# Altium schematic sheet Sheet1.SchDoc
size D; SheetNumber: 1; SheetTotal: 2
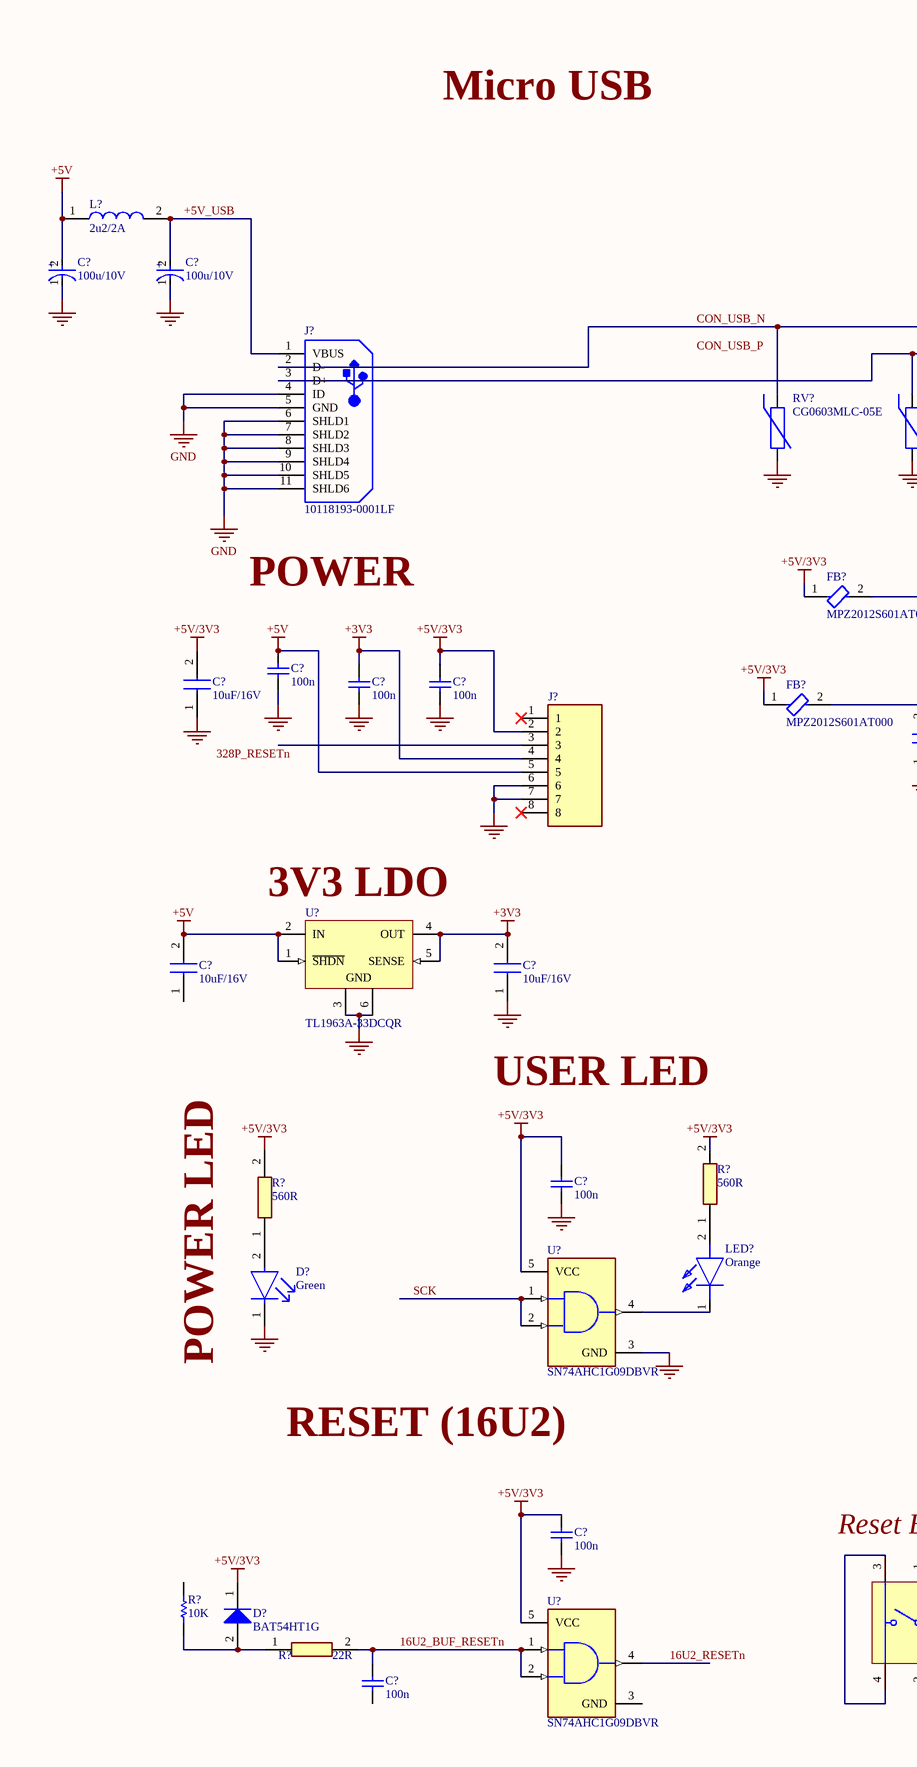
[diagram p0: Sheet1.SchDoc, left]
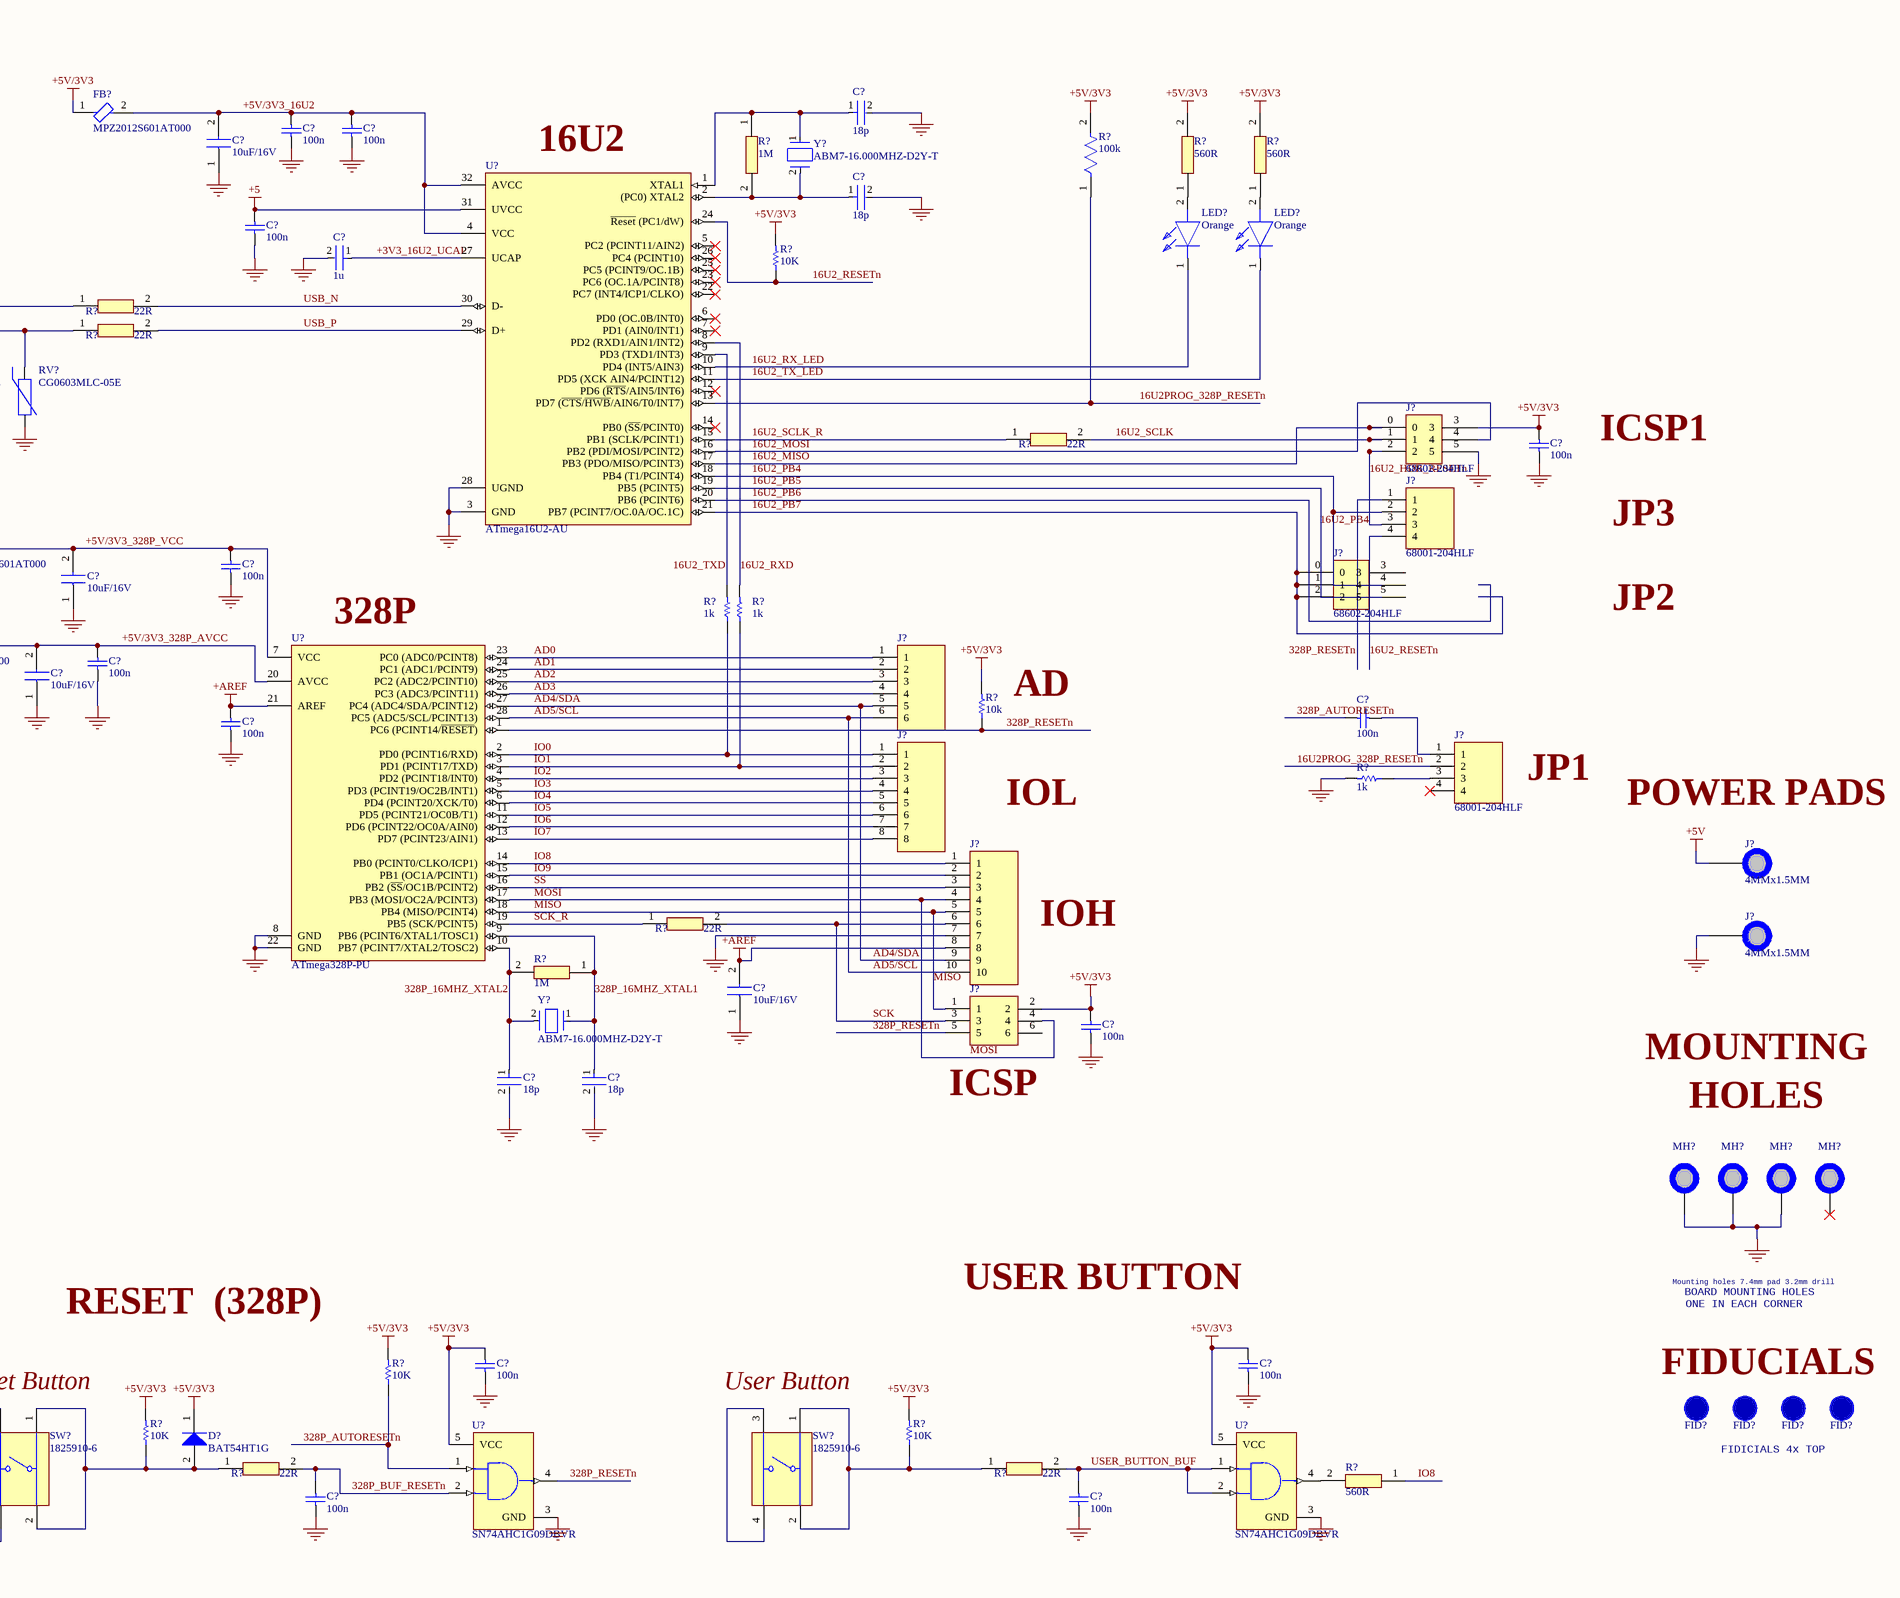
[diagram p1: Sheet1.SchDoc, right]

## Parts
(Parts that share a designator on the sheet are numbered #1, #2 ... from top to bottom, then left to right.)
C?#1  18p  [FP-C0805C-DN-MFG]
C?#2  100n  [CAPC2013X145X20LL20]
C?#3  100n  [CAPC2013X145X20LL20]
C?#4  10uF/16V  [CAPC2012X145N]
C?#5  18p  [FP-C0805C-DN-MFG]
C?#6  100u/10V  [FP-SC-MFG]
C?#7  100u/10V  [FP-SC-MFG]
C?#8  100n  [CAPC2013X145X20LL20]
C?#9  1u  [FP-C2012-125-0_2-IPC_A]
C?#10  100n  [CAPC2013X145X20LL20]
C?#11  100n  [CAPC2013X145X20LL20]
C?#12  10uF/16V  [CAPC2012X145N]
C?#13  100n  [CAPC2013X145X20LL20]
C?#14  100n  [CAPC2013X145X20LL20]
C?#15  100n  [CAPC2013X145X20LL20]
C?#16  10uF/16V  [CAPC2012X145N]
C?#17  100n  [CAPC2013X145X20LL20]
C?#18  10uF/16V  [CAPC2012X145N]
C?#19  100n  [CAPC2013X145X20LL20]
C?#20  100n  [CAPC2013X145X20LL20]
C?#21  10uF/16V  [CAPC2012X145N]
C?#22  10uF/16V  [CAPC2012X145N]
C?#23  10uF/16V  [CAPC2012X145N]
C?#24  100n  [CAPC2013X145X20LL20]
C?#25  18p  [FP-C0805C-DN-MFG]
C?#26  18p  [FP-C0805C-DN-MFG]
C?#27  100n  [CAPC2013X145X20LL20]
C?#28  100n  [CAPC2013X145X20LL20]
C?#29  100n  [CAPC2013X145X20LL20]
C?#30  100n  [CAPC2013X145X20LL20]
C?#31  100n  [CAPC2013X145X20LL20]
C?#32  100n  [CAPC2013X145X20LL20]
C?#33  100n  [CAPC2013X145X20LL20]
D?#1  Green  [FP-LG_L29K-MFG]
D?#2  BAT54HT1G  [ONSC-SOD-323-2-477-02_V]
D?#3  BAT54HT1G  [ONSC-SOD-323-2-477-02_V]
FB?#1  MPZ2012S601AT000  [FP-MPZ2012-MFG]
FB?#2  MPZ2012S601AT000  [FP-MPZ2012-MFG]
FB?#3  MPZ2012S601AT000  [FP-MPZ2012-MFG]
FID?#1  FID_1MMC  [FID_40X120D]  (value not drawn)  (no BOM)
FID?#2  FID_1MMC  [FID_40X120D]  (value not drawn)  (no BOM)
FID?#3  FID_1MMC  [FID_40X120D]  (value not drawn)  (no BOM)
FID?#4  FID_1MMC  [FID_40X120D]  (value not drawn)  (no BOM)
J?#1  10118193-0001LF  [FCI-10118193-0001LF-5_V]
J?#2  68602-204HLF
J?#3  68001-204HLF  [HDRV4W67P0X254_1X4_1016X241X858P]
J?#4  68602-204HLF
J?#5  M20-7820842  [RHDR8W80P0X254_1X8_2032X254X850P]  (value not drawn)
J?#6  M20-7820646  [HDRV6W70P0X254_1X6_1564X250X865P]  (value not drawn)
J?#7  M20-7820842  [RHDR8W80P0X254_1X8_2032X254X850P]  (value not drawn)
J?#8  68001-204HLF  [HDRV4W67P0X254_1X4_1016X241X858P]
J?#9  M20-7821046  [RHDR10W70P0X254_1X10_2580X250X865P]  (value not drawn)
J?#10  4MMx1.5MM  [PAD_WITH_HOLE_4MMx1.5MM]  (no BOM)
J?#11  4MMx1.5MM  [PAD_WITH_HOLE_4MMx1.5MM]  (no BOM)
J?#12  A2541WV-2x3P-C808D808-G15  [HDRV6W64P254_2X3_762X508X533P]  (value not drawn)
L?  2u2/2A  [INDC3225X270N]
LED?#1  Orange  [SODFL1708X67N]
LED?#2  Orange  [SODFL1708X67N]
LED?#3  Orange  [SODFL1708X67N]
MH?#1  MH_7.4MMC_3.2MMD  [MH_7.4MMD_3.2MMD]  (value not drawn)  (no BOM)
MH?#2  MH_7.4MMC_3.2MMD  [MH_7.4MMD_3.2MMD]  (value not drawn)  (no BOM)
MH?#3  MH_7.4MMC_3.2MMD  [MH_7.4MMD_3.2MMD]  (value not drawn)  (no BOM)
MH?#4  MH_7.4MMNC_3.2MMD  [MH_7.4MMD_3.2MMD_NON_COPPER_NPTH]  (value not drawn)  (no BOM)
R?#1  1M  [RESC2012X60N]
R?#2  100k  [FP-RC0805-0_6-IPC_C]
R?#3  560R  [RESC2012X60N]
R?#4  560R  [RESC2012X60N]
R?#5  10K  [RESC2013X60X35NL10T20]
R?#6  22R  [RESC2012X60N]
R?#7  22R  [RESC2012X60N]
R?#8  22R  [RESC2012X60N]
R?#9  1k  [RESC2013X60X35ML10T20]
R?#10  1k  [RESC2013X60X35ML10T20]
R?#11  10k  [RESC2013X60X35NL10T20]
R?#12  1k  [RESC2013X60X35ML10T20]
R?#13  22R  [RESC2012X60N]
R?#14  1M  [RESC2012X60N]
R?#15  560R  [RESC2012X60N]
R?#16  560R  [RESC2012X60N]
R?#17  10K  [RESC2013X60X35NL10T20]
R?#18  10K  [RESC2013X60X35NL10T20]
R?#19  10K  [RESC2013X60X35NL10T20]
R?#20  10K  [RESC2013X60X35NL10T20]
R?#21  22R  [RESC2012X60N]
R?#22  22R  [RESC2012X60N]
R?#23  560R  [RESC2012X60N]
R?#24  22R  [RESC2012X60N]
RV?#1  CG0603MLC-05E  [BOUR-CG0603-2_V]
RV?#2  CG0603MLC-05E  [BOUR-CG0603-2_V]
SW?#1  1825910-6  [TECO-1825910-6_V]
SW?#2  1825910-6  [TECO-1825910-6_V]
U?#1  ATmega16U2-AU  [32A_M]
U?#2  ATmega328P-PU  [28P3]
U?#3  TL1963A-33DCQR  [DCQ0006A_L]
U?#4  SN74AHC1G09DBVR  [FP-DBV0005A-MFG]
U?#5  SN74AHC1G09DBVR  [FP-DBV0005A-MFG]
U?#6  SN74AHC1G09DBVR  [FP-DBV0005A-MFG]
U?#7  SN74AHC1G09DBVR  [FP-DBV0005A-MFG]
Y?#1  ABM7-16.000MHZ-D2Y-T  [FP-ABM7-MFG]
Y?#2  ABM7-16.000MHZ-D2Y-T  [FP-ABM7-MFG]

## Nets
+3V3: C?#14.2 C?#22.2 J?#5.4 U?#3.4(OUT) U?#3.5(SENSE)
+5: C?#8.2 U?#1.31(UVCC)
+5V: C?#6.2(A) C?#13.2 C?#21.2 J?#5.5 J?#10.1 L?.1 U?#3.1(~{SHDN}) U?#3.2(IN)
+5V/3V3: C?#10.2 C?#15.2 C?#16.2 C?#24.2 C?#27.2 C?#28.2 C?#29.2 C?#30.2 D?#2.1(K) D?#3.1(K) FB?#1.1 FB?#2.1 FB?#3.1 J?#2.3 J?#5.2 J?#12.2 R?#2.2 R?#3.2 R?#4.2 R?#5.2 R?#11.2 R?#15.2 R?#16.2 R?#17.2 R?#18.2 R?#19.2 U?#4.5(VCC) U?#5.5(VCC) U?#6.5(VCC) U?#7.5(VCC)
+AREF: C?#20.2 C?#23.2 J?#9.8 U?#2.21(AREF)
GND: C?#1.2 C?#2.1 C?#3.1 C?#4.1 C?#5.2 C?#6.1(C) C?#7.1(C) C?#8.1 C?#9.2 C?#10.1 C?#11.1 C?#12.1 C?#13.1 C?#14.1 C?#15.1 C?#16.1 C?#17.1 C?#18.1 C?#20.1 C?#22.1 C?#23.1 C?#24.1 C?#25.2 C?#26.2 C?#27.1 C?#28.1 C?#29.1 C?#30.1 C?#31.1 C?#32.1 D?#1.1(C) J?#1.4(ID) J?#1.5(GND) J?#1.6(SHLD1) J?#1.7(SHLD2) J?#1.8(SHLD3) J?#1.9(SHLD4) J?#1.10(SHLD5) J?#1.11(SHLD6) J?#2.5 J?#5.6 J?#5.7 J?#9.7 J?#11.1 MH?#1.1 MH?#2.1 MH?#3.1 R?#12.2 RV?#1.2 RV?#2.2 U?#1.3(GND) U?#1.28(UGND) U?#2.8(GND) U?#2.22(GND) U?#3.3(GND) U?#3.6(GND) U?#4.3(GND) U?#5.3(GND) U?#6.3(GND)
16U2_BUF_RESETn: C?#33.2 R?#24.2 U?#7.1(A) U?#7.2(B)
16U2_HDR_RESETn: J?#2.2 J?#3.3
16U2_MISO: J?#2.0 U?#1.17(PB3_(PDO/MISO/PCINT3))
16U2_MOSI: J?#2.4 U?#1.16(PB2_(PDI/MOSI/PCINT2))
16U2_PB4: J?#3.2 U?#1.18(PB4_(T1/PCINT4))
16U2_PB5: U?#1.19(PB5_(PCINT5))
16U2_PB6: U?#1.20(PB6_(PCINT6))
16U2_PB7: J?#4.0 J?#4.1 J?#4.2 U?#1.21(PB7_(PCINT7/OC.0A/OC.1C))
16U2_RESETn: J?#3.4 R?#5.1 U?#1.24(~{Reset}_(PC1/dW)) U?#7.4(Y)
16U2_RX_LED: LED?#1.1(K) U?#1.10(PD4_(INT5/AIN3))
16U2_RXD: R?#10.2 U?#1.8(PD2_(RXD1/AIN1/INT2))
16U2_SCLK: J?#2.1 R?#8.2
16U2_SCLK_R: R?#8.1 U?#1.15(PB1_(SCLK/PCINT1))
16U2_TX_LED: LED?#2.1(K) U?#1.11(PD5_(XCK_AIN4/PCINT12))
16U2_TXD: R?#9.2 U?#1.9(PD3_(TXD1/INT3))
16U2PROG_328P_RESETn: J?#8.2 R?#2.1 U?#1.13(PD7_(~{CTS}/~{HWB}/AIN6/T0/INT7))
328P_16MHZ_XTAL1: C?#26.1 R?#14.1 U?#2.9(PB6_(PCINT6/XTAL1/TOSC1)) Y?#2.1
328P_16MHZ_XTAL2: C?#25.1 R?#14.2 U?#2.10(PB7_(PCINT7/XTAL2/TOSC2)) Y?#2.2
328P_AUTORESETn: C?#19.2 R?#17.1 U?#5.1(A)
328P_BUF_RESETn: C?#31.2 R?#21.2 U?#5.2(B)
328P_RESETn: J?#3.1 J?#5.3 J?#12.5 R?#11.1 U?#2.1(PC6_(PCINT14/~{RESET})) U?#5.4(Y)
+3V3_16U2_UCAP: C?#9.1 U?#1.27(UCAP)
+5V/3V3_16U2: C?#2.2 C?#3.2 C?#4.2 FB?#1.2 U?#1.4(VCC) U?#1.32(AVCC)
+5V/3V3_328P_AVCC: C?#17.2 C?#18.2 FB?#3.2 U?#2.20(AVCC)
+5V/3V3_328P_VCC: C?#11.2 C?#12.2 FB?#2.2 U?#2.7(VCC)
+5V_USB: C?#7.2(A) J?#1.1(VBUS) L?.2
AD0: J?#6.1 U?#2.23(PC0_(ADC0/PCINT8))
AD1: J?#6.2 U?#2.24(PC1_(ADC1/PCINT9))
AD2: J?#6.3 U?#2.25(PC2_(ADC2/PCINT10))
AD3: J?#6.4 U?#2.26(PC3_(ADC3/PCINT11))
AD4/SDA: J?#6.5 J?#9.9 U?#2.27(PC4_(ADC4/SDA/PCINT12))
AD5/SCL: J?#6.6 J?#9.10 U?#2.28(PC5_(ADC5/SCL/PCINT13))
CON_USB_N: J?#1.2(D-) R?#6.1 RV?#1.1
IO0: J?#7.1 R?#9.1 U?#2.2(PD0_(PCINT16/RXD))
IO1: J?#7.2 R?#10.1 U?#2.3(PD1_(PCINT17/TXD))
IO2: J?#7.3 U?#2.4(PD2_(PCINT18/INT0))
IO3: J?#7.4 U?#2.5(PD3_(PCINT19/OC2B/INT1))
IO4: J?#7.5 U?#2.6(PD4_(PCINT20/XCK/T0))
IO5: J?#7.6 U?#2.11(PD5_(PCINT21/OC0B/T1))
IO6: J?#7.7 U?#2.12(PD6_(PCINT22/OC0A/AIN0))
IO7: J?#7.8 U?#2.13(PD7_(PCINT23/AIN1))
IO8: J?#9.1 R?#23.1 U?#2.14(PB0_(PCINT0/CLKO/ICP1))
IO9: J?#9.2 U?#2.15(PB1_(OC1A/PCINT1))
MISO: J?#9.5 J?#12.1 U?#2.18(PB4_(MISO/PCINT4))
MOSI: J?#9.4 J?#12.4 U?#2.17(PB3_(MOSI/OC2A/PCINT3))
SCK: J?#9.6 J?#12.3 R?#13.2 U?#4.1(A) U?#4.2(B)
SCK_R: R?#13.1 U?#2.19(PB5_(SCK/PCINT5))
SS: J?#9.3 U?#2.16(PB2_(~{SS}/OC1B/PCINT2))
USB_N: R?#6.2 U?#1.30(D-)
USB_P: R?#7.2 U?#1.29(D+)
USER_BUTTON_BUF: C?#32.2 R?#22.2 U?#6.1(A) U?#6.2(B)
NetC?#1_1: C?#1.1 R?#1.1 U?#1.1(XTAL1) Y?#1.1
NetC?#5_1: C?#5.1 R?#1.2 U?#1.2((PC0)_XTAL2) Y?#1.2
NetC?#19_1: C?#19.1 J?#8.1
NetD?#1_2: D?#1.2(A) R?#16.1
NetD?#2_2: D?#2.2(A) R?#18.1 R?#21.1 SW?#1.1 SW?#1.2
NetD?#3_2: D?#3.2(A) R?#20.1 R?#24.1
NetJ?#1_3: J?#1.3(D+) R?#7.1 RV?#2.1
NetJ?#8_3: J?#8.3 R?#12.1
NetLED?#1_2: LED?#1.2(A) R?#3.1
NetLED?#2_2: LED?#2.2(A) R?#4.1
NetLED?#3_1: LED?#3.1(K) U?#4.4(Y)
NetLED?#3_2: LED?#3.2(A) R?#15.1
NetR?#19_1: R?#19.1 R?#22.1 SW?#2.1 SW?#2.2
NetR?#23_2: R?#23.2 U?#6.4(Y)
NetSW?#1_3: SW?#1.3 SW?#1.4
NetSW?#2_3: SW?#2.3 SW?#2.4

Not connected (* = marked no-connect by the designer): C?#21 1; C?#33 1; J?#4 3 4 5; J?#5 1* 8*; J?#8 4*; J?#12 6; MH?#4 1*; R?#20 2; U?#1 5(PC2_(PCINT11/AIN2))* 6(PD0_(OC.0B/INT0))* 7(PD1_(AIN0/INT1))* 12(PD6_(~{RTS}/AIN5/INT6))* 14(PB0_(~{SS}/PCINT0))* 22(PC7_(INT4/ICP1/CLKO))* 23(PC6_(OC.1A/PCINT8))* 25(PC5_(PCINT9/OC.1B))* 26(PC4_(PCINT10))*; U?#7 3(GND)

## Notes on the sheet
- Micro USB
- (near U?#1) 16U2
- ICSP1
- JP3
- POWER
- (near U?#2) 328P
- JP2
- (near R?#11) AD
- IOL
- JP1
- POWER PADS
- (near U?#3) 3V3 LDO
- IOH
- USER LED
- POWER LED
- (near J?#12) ICSP
- MOUNTING
- HOLES
- USER BUTTON
- Mounting holes 7.4mm pad 3.2mm drill
- BOARD MOUNTING HOLES
- (near U?#4) RESET (16U2)
- RESET  (328P)
- ONE IN EACH CORNER
- Reset Button
- User Button
- (near FID?#1) FIDUCIALS
- (near FID?#2) FIDICIALS 4x TOP
- Labels drawn without touching a wire or pin: CON_USB_P
- (in symbol CMP-05427-000047-1) +

## Library data of the parts
C?#1 C?#5 C?#25 C?#26 = CMP-2007-00302-2: CAP CER 18PF 50V C0G/NP0 0805; Manufacturer: KEMET; Manufacturer Part Number: C0805C180J5GACTU; Temperature Characteristic: C0G; Tolerance: 0.05; Material: Ceramic; Temperature Coefficient: 30ppm/°C; Device Class L2: Capacitors; Capacitance: 18 pF; Temperature: -55°C to +125°C; Value: 18 pF; Package: C0805C-DN; Mouser Description: Cap Ceramic 18pF 50V C0G 5% SMD 0805 125C Paper T/R; Height: 0.88mm; ComponentLink2URL: https://content.kemet.com/datasheets/KEM_C1003_C0G_SMD.pdf; RoHS: TRUE; Octopart: https://octopart.com/c0805c180j5gactu-kemet-144810; ComponentLink2Description: Datasheet; Temperature Range High: +125°C; Digikey Description: CAP CER 18PF 50V C0G/NP0 0805; Device Class L1: Passive Components; Category: Cap; Automotive: No; Device Class L3: Ceramic Capacitors; Voltage Rating: 50 V; Temperature Range Low: -55°C; Ipc Land Pattern Name: CAPC200125X78; Lead Free: Yes
C?#2 C?#3 C?#8 C?#10 C?#11 C?#13-C?#15 C?#17 C?#19 C?#20 C?#24 C?#27-C?#33 = CMP-2000-07557-1: Chip Capacitor, 0.1 uF, +/- 10%, 50 V, -55 to 125 degC, 0805 (2012 Metric), RoHS, Tape and Reel; Manufacturer: TDK; Voltage Rating: 50V; Dielectric Material: Ceramic; Capacitance: 100nF; Dielectric: X7R; Datasheet Version: 07/2017; Max Operating Temperature: 125degC; RoHSCompliant: True; Min Operating Temperature: -55degC; Case/Package: 0805; Composition: Ceramic; Width: 0.049inch; Thickness: 0.037inch; Datasheet URL: https://product.tdk.com/info/en/catalog/datasheets/mlcc_commercial_general_en.pdf; Height: 0.85mm; Voltage Rating (DC): 50V; Voltage: 50V; Packaging: TapeandReel; Mounting Technology: SurfaceMount; Case Code (Metric): 2012; Length: 2mm; Radiation Hardening: No; Number of Pins: 2; REACH SVHC: NoSVHC; Lead Free: LeadFree; Package Reference: 805; Weight: 0.000194oz; Tolerance: 10%; Package Description: 2-Pin Surface Mount Device, Body 2 x 1.25 mm; Manufacturer URL: http://www.tdk.com/; Package Quantity: 1; Case Code (Imperial): 0805; Mount: SurfaceMount; Depth: 1.25mm; Termination: SMD/SMT
C?#4 C?#12 C?#16 C?#18 C?#21-C?#23 = C2012X5R1C106M125AC: Capacitor; Manufacturer_Name: TDK; Datasheet Link: https://product.tdk.com/info/en/catalog/datasheets/mlcc_commercial_midvoltage_en.pdf; Height: 1.45mm; Manufacturer_Part_Number: C2012X5R1C106M125AC; Mouser Part Number: 810-C2012X5R1C106M-3; Mouser Price/Stock: https://www.mouser.co.uk/ProductDetail/TDK/C2012X5R1C106M125AC?qs=LcTL%2F5vFEzHcq9TBdtOIgw%3D%3D
C?#6 C?#7 = CMP-05427-000047-1: CAP ALUM 100UF 20% 10V SMD; Life (Hours): 1000Hour; Ripple Current: 50mA; Packaging: Tape and Reel; Diameter: 5mm; Voltage Rating (DC): 10V; Mount: Surface Mount; Max Operating Temperature: 85°C; Length: 5.5mm; Case/Package: Radial; Height: 5.4mm; Construction: Cylindrical; Termination: SMD/SMT; Height - Seated (Max): 0.213inch; Series: S; Min Operating Temperature: -40°C; Capacitance: 100uF; Tolerance: 20%; Voltage Rating: 10V; Package Quantity: 1; Radiation Hardening: No; Ripple Current (AC): 50mA; Lead Free: Lead Free; RoHS Compliant: Yes; Contact Plating: Tin
C?#9 = CMP-08246-005389-1: Multilayer Ceramic Capacitors 1μF ±10% 25V X5R SMD 0805; Capacitance: 1uF; Min Operating Temperature: -55°C; Construction: Flat; Package Quantity: 2000; Height: 1.25mm; Resistor Type: Ceramic; Case/Package: 0805; Depth: 1.25mm; Case Code (Metric): 2012; Weight: 0.000194oz; REACH SVHC: No SVHC; Dielectric: X5R; Max Operating Temperature: 85°C; Number of Pins: 2; Thickness: 0.057inch; RoHS Compliant: Yes; Radiation Hardening: No; Lead Free: Lead Free; Case Code (Imperial): 0805; Length: 2mm; Voltage Rating: 25V; Mount: Surface Mount; Voltage Rating (DC): 25V; Packaging: Tape and Reel; Dielectric Material: Ceramic; Termination: SMD/SMT; Voltage: 25V; Tolerance: 10%; Series: C; Width: 0.049inch
D?#1 = CMP-62016-000024-1: LED GREEN DIFFUSED 0603 SMD; Number of LEDs: 1; Forward Current: 20mA; Luminous Intensity: 5.6mcd; Luminous Flux: 0.012lm; Dominant Wavelength: 570nm; Lens Style: Flat; Forward Voltage: 2.2V; Reverse Voltage: 12V; Viewing Angle: 160°; Lens Size: 0.8mm; Test Current: 2mA; Lens Color: White; Length: 1.3mm; Radiation Hardening: No; Color: Green; Number of Pins: 2; Depth: 0.8mm; Number of Elements: 1; Case Code (Metric): 1608; Case Code (Imperial): 0603; Illumination Color: Green; Width: 0.8mm; Lens Transparency: Diffused; Mount: Surface Mount; Min Operating Temperature: -40°C; Packaging: Tape and Reel; Max Operating Temperature: 100°C; Case/Package: 0603; Height: 0.65mm; Package Quantity: 5000
D?#2 D?#3 = CMP-1055-00462-1: Schottky Barrier Diode, 2-Pin SOD-323, Pb-Free, Tape and Reel; Manufacturer: On Semiconductor; Configuration: Single; trr Max (ns): 5; IFSM Max (A): 0.6; ComponentLink3URL: http://www.onsemi.com/pub_link/Collateral/477-02.PDF.1; PackageDescription: 2-Pin SOD, Body 1.7 x 1.25 mm; ComponentLink2URL: http://www.onsemi.cn/pub_link/Collateral/BAT54HT1-D.PDF; ComponentLink3Description: Package Specification; ComponentLink2Description: Datasheet; DatasheetVersion: Rev. 6; PackageReference: SOD-323-2-477-02; RoHS: TRUE; ComponentLink1URL: http://www.onsemi.com/; Packing: Tape and Reel; PartNumber: BAT54HT1G; Mounting Technology: Surface Mount; ComponentLink1Description: Manufacturer URL; PackageVersion: Rev. H, 03/2007
FB?#1-FB?#3 = CMP-2000-05401-2: Manufacturer Lifecycle Status: PRODUCTION; NexarPartId: 12090955; RMS Current (Irms): 2A; Test Frequency: 100MHz; Tolerance: 25%; Core Material: Ferrite; Series Resistance: 100mΩ; Impedance: 600Ω; Packaging: Digi-Reel®; Length: 2mm; Min Operating Temperature: -55°C; Width: 1.25mm; Max Width: 1.45mm; Lead Free: Lead Free; Current Rating: 2A; Case Code (Imperial): 0805; Min Length: 1.8mm; Schedule B: 8504500000, 8504500000; REACH SVHC: No SVHC; Case Code (Metric): 2012; Max DC Current: 2A; Case/Package: 0805; Lifecycle Status: Production; Min Width: 1.05mm; Mount: Surface Mount; Height: 1.0414mm; Resistance: 100mΩ; DC Resistance (DCR): 100mΩ; Max Operating Temperature: 125°C; Max Length: 2.2mm; RoHS: Compliant
FID?#1-FID?#4 = FID_1MMC: Fiducial 40mil Diameter, 120mil Mask; Supplier: Digikey
J?#1 = CMP-2000-05119-1: Micro USB B Type Receptacle, -55 to 85 degC, 5-Pin SMD, RoHS, Tape and Reel; Manufacturer: FCI; Insulation Resistance: 1000MOhms; Gender: Female; Current Rating: 1.8A; Number of Contacts: 5Contact; Connector Type: MicroUSBTypeBreceptacle; Mounting Angle: Right; Datasheet Version: Rev. C, 05/2015; Packaging: Reel; Product Category: USBConnectors; Standard: USB2.0; Factory Pack Quantity: 1200; Operating Temperature Range: -55Cto+85C; Termination Style: SMD/SMT; Datasheet URL: http://datasheet.octopart.com/10118193-0001LF-FCI-datasheet-55953155.pdf; Contact Material: CopperAlloy; RoHS: Details; Contact Plating: Gold; Flammability Rating: UL94V-0; Manufacturer URL: http://www.fci.com/; Brand: FCI; Product: MicroUSBTypeBConnectors; Color: Black
J?#2 J?#4 = 68602-204HLF: CONN HEADER VERT 4POS 2.54MM; Manufacturer: Amphenol ICC / FCI; Supplier: Newark; Supplier Part Number: 28AH8858; Manufacturer Part Number: 68602-204HLF; RoHS: No; Category: Connectors; Pricing: 1=0,245, 10=0,243, 25=0,241, 50=0,238, 100=0,236, 250=0,234 (USD); ComponentLink1URL: https://cdn.amphenol-icc.com/media/wysiwyg/files/drawing/67996.pdf?src-supplier=Digikey; ComponentLink1Description: https://cdn.amphenol-icc.com/media/wysiwyg/files/drawing/67996.pdf?src-supplier=Digikey; ComponentLink2URL: https://cdn.amphenol-icc.com/media/wysiwyg/files/drawing/67996.pdf?src-supplier=Avnet; ComponentLink2Description: https://cdn.amphenol-icc.com/media/wysiwyg/files/drawing/67996.pdf?src-supplier=Avnet; ComponentLink3URL: https://cdn.amphenol-icc.com/media/wysiwyg/files/drawing/67996.pdf?src-supplier=Mouser; ComponentLink3Description: https://cdn.amphenol-icc.com/media/wysiwyg/files/drawing/67996.pdf?src-supplier=Mouser; ComponentLink4URL: https://datasheet.octopart.com/68602-204HLF-Amphenol-Communications-Solutions-datasheet-36854132.pdf?src-supplier=Newark; ComponentLink4Description: https://datasheet.octopart.com/68602-204HLF-Amphenol-Communications-Solutions-datasheet-36854132.pdf?src-supplier=Newark; ComponentLink5URL: https://cdn.amphenol-icc.com/media/wysiwyg/files/drawing/67996.pdf?src-supplier=Allied+Electronics; ComponentLink5Description: https://cdn.amphenol-icc.com/media/wysiwyg/files/drawing/67996.pdf?src-supplier=Allied+Electronics; ComponentLink6URL: https://cdn.amphenol-icc.com/media/wysiwyg/files/drawing/67996.pdf?src-supplier=Heilind+Electronics; ComponentLink6Description: https://cdn.amphenol-icc.com/media/wysiwyg/files/drawing/67996.pdf?src-supplier=Heilind+Electronics
J?#3 J?#8 = 68001-204HLF: Connector; Manufacturer_Name: Amphenol Communications Solutions; Datasheet Link: https://cdn.amphenol-cs.com/media/wysiwyg/files/drawing/68000.pdf; Height: 8.58mm; Manufacturer_Part_Number: 68001-204HLF
J?#5 J?#7 = M20-7820842: Connector; Manufacturer_Name: Harwin; Datasheet Link: https://cdn.harwin.com/pdfs/M20-782.pdf; Height: 8.5mm; Manufacturer_Part_Number: M20-7820842; Mouser Part Number: 855-M20-7820842; Mouser Price/Stock: https://www.mouser.co.uk/ProductDetail/Harwin/M20-7820842?qs=WS5Jv%252B%252Bx1qXOep0XOTvy2Q%3D%3D
J?#6 = M20-7820646: Connector; Manufacturer_Name: Harwin; Datasheet Link: https://cdn.harwin.com/pdfs/M20-782.pdf; Height: 8.65mm; Manufacturer_Part_Number: M20-7820646; Mouser Part Number: 855-M20-7820646; Mouser Price/Stock: https://www.mouser.co.uk/ProductDetail/Harwin/M20-7820646?qs=WS5Jv%252B%252Bx1qWZs4rbTjPGWw%3D%3D
J?#9 = M20-7821046: Connector; Manufacturer_Name: Harwin; Datasheet Link: https://cdn.harwin.com/pdfs/M20-782.pdf; Height: 8.65mm; Manufacturer_Part_Number: M20-7821046; Mouser Part Number: 855-M20-7821046; Mouser Price/Stock: https://www.mouser.co.uk/ProductDetail/Harwin/M20-7821046?qs=Jph8NoUxIfXTsFl0wvOA6g%3D%3D
J?#10 J?#11 = PAD_WITH_HOLE_4MMx1.5MM: Pad with a hole 4mm x 1.5mm
J?#12 = A2541WV-2x3P-C808D808-G15: Connector; Manufacturer_Name: Changjiang Connectors; Datasheet Link: https://www.cjt.com/Upload/A2541.pdf; Height: 5.33mm; Manufacturer_Part_Number: A2541WV-2x3P-C808D808-G15
L? = L1210R2R2MDWIT: Inductor; Manufacturer_Name: KEMET; Datasheet Link: https://content.kemet.com/datasheets/KEM_L9015_L-DWI.pdf; Height: 2.7mm; Manufacturer_Part_Number: L1210R2R2MDWIT; Mouser Part Number: 80-L1210R2R2MDWIT; Mouser Price/Stock: https://www.mouser.co.uk/ProductDetail/KEMET/L1210R2R2MDWIT?qs=v1sh8PPj49i7zaK1i33Fzg%3D%3D; Arrow Part Number: L1210R2R2MDWIT; Arrow Price/Stock: https://www.arrow.com/en/products/l1210r2r2mdwit/kemet-corporation?region=nac
LED?#1-LED?#3 = LO_L29K-H2K1-24-Z: LED; Manufacturer_Name: ams OSRAM; Manufacturer_Part_Number: LO L29K-H2K1-24-Z; Datasheet Link: https://datasheet.datasheetarchive.com/originals/distributors/DKDS41/DSANUWW0036666.pdf; Height: 0.67mm; Mouser Part Number: 720-LOL29KH2K124Z; Mouser Price/Stock: https://www.mouser.com/Search/Refine.aspx?Keyword=720-LOL29KH2K124Z; Arrow Part Number: LO L29K-H2K1-24-Z; Arrow Price/Stock: https://www.arrow.com/en/products/lol29k-h2k1-24-z/osram-opto-semiconductors
MH?#1-MH?#3 = MH_7.4MMC_3.2MMD: Mounting Hole 7.4mm Diameter, 3.2mm Drill; .Creator: MM
MH?#4 = MH_7.4MMNC_3.2MMD: Mounting Hole 7.4mm Diameter (Non Copper), 3.2mm Drill NPTH
R?#1 R?#14 = RC0805FR-071ML: Resistor; Manufacturer_Name: KEMET; Datasheet Link: http://www.yageo.com/documents/recent/PYu-RC_Group_51_RoHS_L_10.pdf; Height: 0.6mm; Manufacturer_Part_Number: RC0805FR-071ML; Mouser Part Number: 603-RC0805FR-071ML; Mouser Price/Stock: https://www.mouser.co.uk/ProductDetail/YAGEO/RC0805FR-071ML?qs=8Y8p%252BasKcI6wvSL4jxV1pQ%3D%3D; Arrow Part Number: RC0805FR-071ML; Arrow Price/Stock: https://www.arrow.com/en/products/rc0805fr-071ml/yageo?region=europe
R?#2 = CMP-2100-03668-5: RES 100K OHM 1% 1/8W 0805; Power Rating: 125mW; Temperature Coefficient: 100ppm/°C; Voltage Rating (DC): 150V; Resistance: 100kR; Package Quantity: 1; Case/Package: 0805; Lead Pitch: 0.4mm; Case Code (Imperial): 0805; Construction: Rectangular; Number of Terminations: 2; RoHS Compliant: Yes; Max Power Dissipation: 125mW; Tolerance: 1%; Max Operating Temperature: 155°C; Resistance Tolerance: 1%; Lead Free: Lead Free; Packaging: Tape and Reel; Resistor Type: Thick Film; Min Operating Temperature: -55°C; Case Code (Metric): 2012; Series: RC; Technology: THICK FILM; Voltage Rating: 150V; Termination: SMD/SMT; Width: 0.049inch; Number of Pins: 2; Features: Moisture Resistant; Military Standard: Not; Length: 0.079inch; Depth: 1.25mm; Size Code: 0805; Height: 0.024inch
R?#3 R?#4 R?#15 R?#16 R?#23 = RC0805FR-07560RL: Resistor; Manufacturer_Name: KEMET; Datasheet Link: http://www.yageo.com/documents/recent/PYu-RC_Group_51_RoHS_L_10.pdf; Height: 0.6mm; Manufacturer_Part_Number: RC0805FR-07560RL; Mouser Part Number: 603-RC0805FR-07560RL; Mouser Price/Stock: https://www.mouser.co.uk/ProductDetail/YAGEO/RC0805FR-07560RL?qs=g6xwsc4j%252B%2Foqaguphwrcog%3D%3D; Arrow Part Number: RC0805FR-07560RL; Arrow Price/Stock: https://www.arrow.com/en/products/rc0805fr-07560rl/yageo?region=nac
R?#5 R?#11 R?#17-R?#20 = CMP-1659-00013-4: Chip Resistor, 10 KOhm, +/- 1%, 0.125 W, -55 to 155 degC, 0805 (2012 Metric), RoHS, Tape and Reel; Manufacturer: Yageo; Voltage Rating: 150 V; Mount: Surface Mount; ComponentLink1Description: Manufacturer URL; ComponentLink2URL: http://www.yageo.com/documents/recent/PYu-RC_Group_51_RoHS_L_04.pdf; Pins: 2; Length: 2 mm; Min Operating Temperature: -55 degC; Height: 0.5 mm; Mounting Technology: Surface Mount; RoHSCompliant: true; REACH SVHC: No SVHC; ComponentLink1URL: http://www.yageo.com/; Max Operating Temperature: 155 degC; PackageReference: 0805; DatasheetVersion: Rev. 4, 02/2016; Package Quantity: 5000; Packaging: Tape and Reel; ComponentLink2Description: Datasheet; PackageDescription: 2-Pin Surface Mounted Device, Body 2 x 1.25 mm
R?#6-R?#8 R?#13 R?#21 R?#22 R?#24 = RC0805FR-0722RL: Resistor; Manufacturer_Name: KEMET; Datasheet Link: http://www.yageo.com/documents/recent/PYu-RC_Group_51_RoHS_L_10.pdf; Height: 0.6mm; Manufacturer_Part_Number: RC0805FR-0722RL; Mouser Part Number: 603-RC0805FR-0722RL; Mouser Price/Stock: https://www.mouser.com/Search/Refine.aspx?Keyword=603-RC0805FR-0722RL; Arrow Part Number: RC0805FR-0722RL; Arrow Price/Stock: https://www.arrow.com/en/products/rc0805fr-0722rl/yageo
R?#9 R?#10 R?#12 = CMP-2100-03671-1: Chip Resistor, 1 KOhm, +/- 1%, 125 mW, -55 to 155 degC, 0805 (2012 Metric), RoHS, Tape and Reel; Manufacturer: Yageo; Temperature Coefficient: 100ppm/degreesC; Voltage Rating (DC): 150V; Max Power Dissipation: 125mW; Resistance: 1KOhm; Number of Pins: 2; Number of Terminations: 2; Datasheet URL: http://www.yageo.com/NewPortal/yageodocoutput?fileName=/pdf/R-Chip/PYu-RC_Group_51_RoHS_L_5.pdf; Length: 0.079inch; Package Description: 2-Pin Surface Mounted Device, Body 2 x 1.25 mm; Depth: 1.25mm; Height: 0.024inch; Military Standard: Not; Case/Package: 0805; Package Reference: 0805; RoHSCompliant: true; Lead Free: LeadFree; Packaging: TapeandReel; Package Quantity: 1; Datasheet Version: Rev. 5, 10/2016; Tolerance: 1%; Min Operating Temperature: -55degC; Voltage Rating: 150V; Composition: ThickFilm; Case Code (Imperial): 0805; Power Rating: 125mW; Width: 0.049inch; Case Code (Metric): 2012; Manufacturer URL: http://www.yageo.com/; Max Operating Temperature: 155degC; REACH SVHC: Unknown; Termination: SMD/SMT
RV?#1 RV?#2 = CMP-0584-00001-2: ESD Protector, 5 V Supply, -40 to 85 degC, 1.6 x 0.8 x 0.55 mm SMD, RoHS, Tape and Reel; Manufacturer: Bourns; VC: 20 V; VT: 150 V; RT: 1 ns; VDC: 5 V; CO: 0.5 pF; PartNumber: CG0603MLC-05E; ComponentLink1Description: Manufacturer URL; ComponentLink1URL: http://www.bourns.com/; Packing: Tape and Reel; Mounting Technology: Surface Mount; ComponentLink2Description: Datasheet; RoHS: TRUE; Operating Temperature: -40 to 85 degC; DatasheetVersion: Rev. S; PackageDescription: 2-Pin SMD, Body 1.6 x 0.8 mm, Pitch 1.52 mm; PackageReference: CG0603-2; ComponentLink2URL: http://www.bourns.com/data/global/pdfs/MLC.pdf
SW?#1 SW?#2 = CMP-1684-00021-1: Tact Switch, SPST-NO, 0.05 A, -35 to 85 degC, 4-Pin THD, RoHS, Bulk; Manufacturer: TE Connectivity; Maximum Contact Resistance: 100mOhm; Mechanical Life: 100000Cycles; Bushing Type: Unthreaded; Switch Configuration: OFF(ON); Maximum DC Voltage Rating: 24V; Contact Rating @ Voltage: 0.05A@24VDC; Actuator Color: Black; Body Orientation: Straight; Function: MomentaryContact; Illumination: N/R; Actuator Style: RoundButton; Actuator Material: PolybutyleneTerephthalate; Dielectric Strength: 500VAC; Pole Throw Configuration: SPST; Actuator Length: 1.4mm; Product Weight: N/A; Contact Material: CopperAlloy; Housing Material: N/A; Terminal Type: PCPins; Minimum Insulation Resistance: 100MOhm; Package Description: 4-Pin Through Hole Device, Body 5.99 x 5.99 mm, Pitch 6.5 mm; Part No: 1825910-6; Package Reference: THD; Base Material: N/A; Manufacturer URL: http://www.te.com; Contact Plating: Silver; RoHS: Yes; Datasheet Version: Rev. C9; Electrical Life: 100000Cycles; Maximum AC Voltage Rating: N/A; Thread Size: N/R; Operating Temperature: -35to85C; Mounting: ThroughHole; Dimension: 5.99x5mm; Datasheet URL: http://www.te.com/commerce/DocumentDelivery/DDEController?Action=showdoc&DocId=Customer+Drawing%7F1825910%7FC9%7Fpdf%7FEnglish%7FENG_CD_1825910_C9.pdf%7F1825910-6; Family: 1825910; Seal Location: N/A; Seal Description: N/A; Packaging: N/A
U?#1 = CMP-0095-00303-3: 8-bit AVR Microcontroller, 2.7-5.5V, 16KB Flash, 512 Bytes EEPROM, 512 Bytes SRAM, 32-pin TQFP, Industrial Grade (-40°C to 85°C); RevisionNote: Schematic symbol corrected; PartNumber: ATmega16U2-AU; ComponentLink1URL: http://www.atmel.com/; ComponentLink2Description: ATmega8U2/16U2/32U2 Datasheet; PackageDescription: 32-Lead, 7x7x1.0 mm Body, 0.8mm Lead Pitch, Thin Profile Plastic Quad Flat Package (TQFP); Code_JEDEC: MS-026-ABA; DatasheetVersion: revD, Nov-2010; ComponentLink2URL: http://www.atmel.com/dyn/resources/prod_documents/doc7799.pdf; ComponentLink3URL: http://www.atmel.com/dyn/resources/prod_documents/7799S.pdf; ComponentLink3Description: ATmega8U2/16U2/32U2 Summary; PackageReference: 32A; PackageVersion: revC, Oct-2010; ComponentLink1Description: Manufacturer URL
U?#2 = CMP-0095-00013-2: 8-bit AVR Microcontroller, 32KB Flash, 1KB EEPROM, 2KB SRAM, 28-pin PDIP, Industrial Grade (-40°C to 85°C); RevisionNote: DatasheetVersion updated. URLs added.; PackageVersion: revB, Sep-2001; PackageDescription: 28-lead (0.300"/7.62mm Wide) Plastic Dual Inline Package (PDIP); DatasheetVersion: revD, May-2011; ComponentLink1Description: Manufacturer URL; ComponentLink1URL: http://www.atmel.com/; PackageReference: 28P3; ComponentLink2Description: ATmega48A/48PA/88A/88PA/168A/168PA/328/328P Datasheet; ComponentLink3URL: http://www.atmel.com/dyn/resources/prod_documents/8271S.pdf; ComponentLink2URL: http://www.atmel.com/dyn/resources/prod_documents/8271.pdf; ComponentLink3Description: ATmega48A/48PA/88A/88PA/168A/168PA/328/328P Summary
U?#3 = CMP-0395-00346-2: Single Output Low Noise LDO, 1.5 A, Fixed 3.3 V Output, 2.1 to 20 V Input, 6-pin SOT-223 (DCQ), -40 to 125 degC, Green (RoHS & no Sb/Br); Manufacturer: Texas Instruments; Iq(Typ)(mA): 1; Fixed Output Options(V): 3.3; Iout(Max)(A): 1.5; Vin(Min)(V): 2.1; SubFamily: Single Channel LDO; Vin(Max)(V): 20; Vdo(Typ)(mV): 340; Accuracy(%): 3; PackageDescription: 6-Pin Plastic Small Outline, Body 3.5 x 6.5 mm, Pitch 1.27 mm; ComponentLink3URL: http://www.ti.com/litv/pdf/mpds098c; DatasheetVersion: SLVS719F; Eco-Plan: Green (RoHS & no Sb/Br); ComponentLink1Description: Manufacturer URL; ComponentLink2URL: http://www.ti.com/general/docs/lit/getliterature.tsp?genericPartNumber=TL1963A-33&fileType=pdf; ComponentLink1URL: http://www.ti.com/; ComponentLink2Description: Datasheet; PackageVersion: 4202109/D; Mounting Technology: Surface Mount; Vout Adj(Min)(V): 3.3; ComponentLink3Description: Package Specification; Vout Adj(Max)(V): 3.3; PackageReference: DCQ0006A; PartNumber: TL1963A-33DCQR
U?#4-U?#7 = CMP-0859-00040-4: IC GATE AND 1CH 2-INP SOT23-5; Manufacturer: Texas Instruments; Number Of Outputs: 1; Standoff Height: 0mm; Max Supply Voltage: 5.5V; Nominal Supply Current: 1uA; Min Supply Voltage: 2V; Max Junction Temp: +150°C; Propagation Delay: 4.6ns; Number Of Inputs: 2; ComponentLink2Description: Datasheet; Temperature: -55°C to +125°C; Ambient Temperature Range High: +125°C; Logic Function Desc: AND; Device Class L1: Integrated Circuits (ICs); Height: 1.45mm; Device Class L3: Logic Gates; ComponentLink2URL: http://www.ti.com/lit/ds/symlink/sn74ahc1g09.pdf; Ambient Temperature Range Low: -55°C; RoHS: TRUE; Mouser Description: IC GATE AND 1CH 2-INP SOT-23-5; Temperature Range Low: -55°C; Digikey Description: IC GATE AND 1CH 2-INP SOT23-5; Ipc Land Pattern Name: SOT95P280X145-5; Octopart: https://octopart.com/sn74ahc1g09dbvr-texas+instruments-20351419; Device Class L2: Logic ICs; Manufacturer Part Number: SN74AHC1G09DBVR; Category: IC; Package: DBV0005A; Automotive: No; Lead Free: Yes; Number Of Circuits: 1; Temperature Range High: +125°C
Y?#1 Y?#2 = CMP-27762-000095-1: Crystal 16MHz ±20ppm 18pF SMD-2 6mm x 3.5mm; ESR (Equivalent Series Resistance): 50R; Frequency Stability: 30ppm; Width: 3.3mm; Frequency: 16MHz; Radiation Hardening: No; Height: 0.055inch; Tolerance: 20ppm; Length: 6mm; Case/Package: CSMD; Lead Free: Lead Free; Min Operating Temperature: -40°C; Termination: SMD/SMT; Operating Frequency: 16 MHz; Resistor Type: Ceramic; Packaging: Tape and Reel; Mount: Surface Mount; Load Capacitance: 18pF; Frequency Tolerance: 20ppm; Depth: 3.5mm; Series: ABM7; Package Quantity: 1000; Max Operating Temperature: 85°C; Number of Pins: 2